# EAGLE schematic gfci-tester (EAGLE 9.6.2)
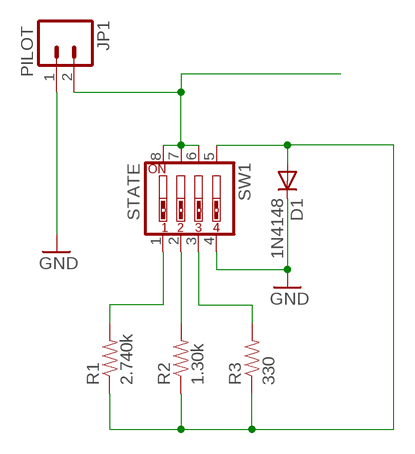
[diagram p0: schematic, sheet 1]

## Parts
D1  1N4148  DIODE1N4148  [DIODE-1N4148]
JP1  PILOT  M023.5MM_LOCK  [SCREWTERMINAL-3.5MM-2_LOCK]
R1  2.740k  RESISTORPTH-1/4W  [AXIAL-0.4]
R2  1.30k  RESISTORPTH-1/4W  [AXIAL-0.4]
R3  330  RESISTORPTH-1/4W  [AXIAL-0.4]
SW1  STATE  SW_DIP-4  [EDG-04]

## Nets
GND: D1.C JP1.1 SW1.4
N$1: D1.A R1.P$1 R2.P$1 R3.P$1 SW1.5
N$2: JP1.2 SW1.6 SW1.7 SW1.8
N$3: R1.P$2 SW1.1
N$4: R2.P$2 SW1.2
N$5: R3.P$2 SW1.3

## Library data of the parts
D1 = SparkFun:DIODE: Diode These are standard reverse protection diodes and small signal diodes. SMA package can handle up to about 1A. SOD-323 can handle about 200mA. What the SOD-323 package when ordering, there are some mfgs out there that are 5-pin packages.
JP1 = SparkFun:M02: Header 2 Standard 2-pin 0.1" header. Use with straight break away headers (SKU : PRT-00116), right angle break away headers (PRT-00553), swiss pins (PRT-00743), machine pins (PRT-00117), and female headers (PRT-00115). Molex polarized connector foot print use with SKU : PRT-08233 with associated crimp pins and housings.
R1-R3 = SparkFun:RESISTOR: Resistor Basic schematic elements and footprints for 0603, 1206, and PTH resistors.
SW1 = special:SW_DIP-4: DIP SWITCH